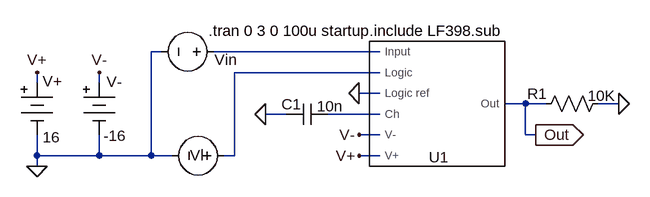
[diagram p0: schematic lf398.asc]
lf398.asc, the LTspice schematic file:
Version 4
SHEET 1 880 680
WIRE -96 176 -112 176
WIRE 240 176 -16 176
WIRE 240 208 16 208
WIRE -288 224 -288 208
WIRE -192 224 -192 208
WIRE 240 240 208 240
WIRE 464 256 432 256
WIRE 496 256 464 256
WIRE 608 256 576 256
WIRE 96 272 64 272
WIRE 240 272 160 272
WIRE 240 304 208 304
WIRE 464 304 464 256
WIRE 480 304 464 304
WIRE -288 336 -288 304
WIRE -192 336 -192 304
WIRE -192 336 -288 336
WIRE -112 336 -112 176
WIRE -112 336 -192 336
WIRE -80 336 -112 336
WIRE 16 336 16 208
WIRE 16 336 0 336
WIRE 240 336 208 336
WIRE -288 352 -288 336
FLAG 480 304 Out
IOPIN 480 304 Out
FLAG 208 240 0
FLAG 64 272 0
FLAG 208 304 V-
FLAG 208 336 V+
FLAG 608 256 0
FLAG -288 208 V+
FLAG -192 208 V-
FLAG -288 352 0
SYMBOL cap 160 256 R90
WINDOW 0 16 56 VBottom 0
WINDOW 3 -12 -3 VTop 0
SYMATTR InstName C1
SYMATTR Value 10n
SYMBOL res 480 272 R270
WINDOW 0 16 2 VTop 0
WINDOW 3 44 101 VBottom 0
SYMATTR InstName R1
SYMATTR Value 10K
SYMBOL voltage 16 336 R90
WINDOW 0 15 58 VBottom 0
WINDOW 3 32 56 Invisible 0
WINDOW 123 0 0 Left 0
SYMATTR InstName Vl
SYMATTR Value SINE(0 2 1 0)
SYMATTR SpiceLine Rser=100 Cpar=100p
SYMBOL Misc\\battery -288 208 R0
WINDOW 0 24 29 Bottom 0
WINDOW 3 22 84 Top 0
WINDOW 123 0 0 Left 0
SYMATTR InstName V+
SYMATTR Value 16
SYMATTR SpiceLine Rser=0.1 Cpar=100p
SYMBOL Misc\\battery -192 208 R0
WINDOW 0 23 30 Bottom 0
WINDOW 3 24 82 Top 0
WINDOW 123 0 0 Left 0
SYMATTR InstName V-
SYMATTR Value -16
SYMATTR SpiceLine Rser=0.1 Cpar=100p
SYMBOL voltage 0 176 R90
WINDOW 0 28 -3 VBottom 0
WINDOW 3 32 56 Invisible 0
WINDOW 123 0 0 Left 0
SYMATTR InstName Vin
SYMATTR Value SINE(0 10 1 0)
SYMATTR SpiceLine Rser=100 Cpar=100p
SYMBOL LF398 304 224 R0
WINDOW 0 11 114 Left 0
SYMATTR InstName U1
TEXT -24 144 Left 0 !.tran 0 3 0 100u startup
TEXT 224 144 Left 0 !.include LF398.sub

The netlist it stands for:
* lf398.asc
C1 N003 0 10n
R1 Out 0 10K
Vl N002 0 SINE(0 2 1 0) Rser=100 Cpar=100p
V+ V+ 0 16 Rser=0.1 Cpar=100p
V- V- 0 -16 Rser=0.1 Cpar=100p
Vin N001 0 SINE(0 10 1 0) Rser=100 Cpar=100p
XU1 N001 N002 0 V- N003 Out V+ LF398H  ; pins Input Logic Logic_ref V- Ch Out V+
.tran 0 3 0 100u startup
.include LF398.sub
.backanno
.end